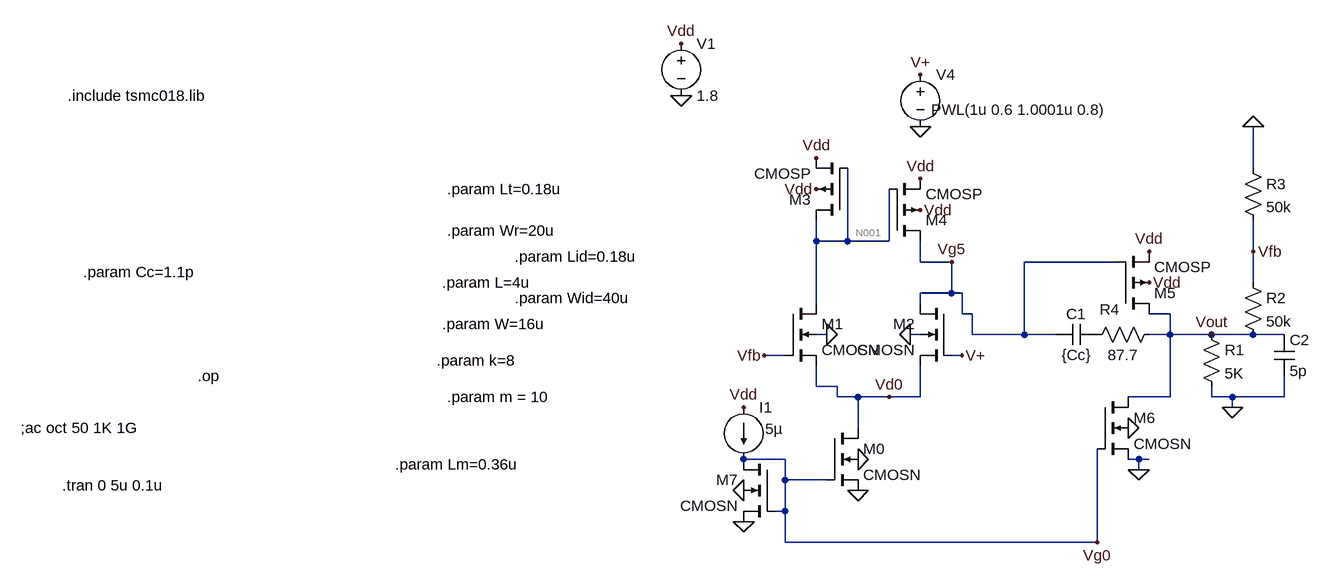
[diagram p0: schematic ProjectLambda.asc]
ProjectLambda.asc, the LTspice schematic file:
Version 4
SHEET 1 2780 868
WIRE 1680 0 1680 -64
WIRE 1008 112 1008 80
WIRE 1056 112 1056 0
WIRE 1056 112 1008 112
WIRE 1120 112 1120 32
WIRE 1120 112 1056 112
WIRE 1680 128 1680 80
WIRE 1168 144 1168 112
WIRE 1216 144 1168 144
WIRE 1472 144 1328 144
WIRE 1680 176 1680 128
WIRE 1216 192 1216 144
WIRE 1216 192 1168 192
WIRE 1232 192 1216 192
WIRE 1008 208 1008 112
WIRE 1168 208 1168 192
WIRE 1232 224 1232 192
WIRE 1248 224 1232 224
WIRE 1552 224 1520 224
WIRE 1024 256 1008 256
WIRE 1168 256 1152 256
WIRE 1248 256 1248 224
WIRE 1328 256 1328 144
WIRE 1328 256 1248 256
WIRE 1376 256 1328 256
WIRE 1552 256 1552 224
WIRE 1552 256 1520 256
WIRE 1616 256 1552 256
WIRE 1680 256 1616 256
WIRE 1728 256 1680 256
WIRE 960 288 928 288
WIRE 1232 288 1216 288
WIRE 1008 336 1008 304
WIRE 1040 336 1008 336
WIRE 1040 352 1040 336
WIRE 1072 352 1040 352
WIRE 1120 352 1072 352
WIRE 1168 352 1168 304
WIRE 1168 352 1120 352
WIRE 1552 352 1552 256
WIRE 1552 352 1488 352
WIRE 1616 352 1616 336
WIRE 1648 352 1616 352
WIRE 1728 352 1728 320
WIRE 1728 352 1648 352
WIRE 1648 368 1648 352
WIRE 1072 400 1072 352
WIRE 960 448 896 448
WIRE 1504 448 1488 448
WIRE 1520 448 1504 448
WIRE 1504 464 1504 448
WIRE 960 480 960 448
WIRE 1024 480 960 480
WIRE 960 528 960 480
WIRE 960 528 944 528
WIRE 960 576 960 528
WIRE 1440 576 1440 432
WIRE 1440 576 960 576
FLAG 800 -112 0
FLAG 896 544 0
FLAG 1072 496 0
FLAG 1504 464 0
FLAG 800 -192 Vdd
FLAG 1008 -16 Vdd
FLAG 1168 16 Vdd
FLAG 1520 128 Vdd
FLAG 1648 368 0
FLAG 1232 288 V+
FLAG 1168 -144 V+
FLAG 1168 -64 0
FLAG 1680 -64 0
FLAG 1680 128 Vfb
FLAG 1616 256 Vout
FLAG 928 288 Vfb
FLAG 1520 176 Vdd
FLAG 1072 448 0
FLAG 896 496 0
FLAG 1168 64 Vdd
FLAG 1008 32 Vdd
FLAG 1152 256 0
FLAG 1024 256 0
FLAG 1440 576 Vg0
FLAG 1216 144 Vg5
FLAG 1120 352 Vd0
FLAG 896 368 Vdd
FLAG 1488 400 0
DATAFLAG 1552 336 ""
DATAFLAG 1168 352 ""
DATAFLAG 1248 224 ""
DATAFLAG 1200 576 ""
SYMBOL voltage 800 -208 R0
WINDOW 123 0 0 Left 0
WINDOW 39 0 0 Left 0
SYMATTR InstName V1
SYMATTR Value 1.8
SYMBOL cmosn 944 448 M0
SYMATTR InstName M7
SYMATTR Value2 l={L} w={W} ad={W*Lm} as={W*Lm} pd={2*(W+Lm)} ps={2*(W+Lm)}
SYMBOL cmosp 1056 80 R180
SYMATTR InstName M3
SYMATTR Value2 l={Lt} w={Wr} ad={Wr*Lm} as={Wr*Lm} pd={2*(Wr+Lm)} ps={2*(Wr+Lm)}
SYMBOL current 896 368 R0
WINDOW 123 0 0 Left 0
WINDOW 39 0 0 Left 0
WINDOW 3 33 33 Left 2
SYMATTR Value 5µ
SYMATTR InstName I1
SYMBOL cap 1440 240 R90
WINDOW 0 0 32 VBottom 2
WINDOW 3 32 32 VTop 2
SYMATTR InstName C1
SYMATTR Value {Cc}
SYMBOL res 1600 240 R0
SYMATTR InstName R1
SYMATTR Value 5K
SYMBOL cap 1712 256 R0
SYMATTR InstName C2
SYMATTR Value 5p
SYMBOL cmosn 1024 400 R0
SYMATTR InstName M0
SYMATTR Value2 l={L} w={m*W} ad={m*W*Lm} as={m*W*Lm} pd={2*(10*W+Lm)} ps={2*(m*10*W+Lm)}
SYMBOL cmosn 1440 352 R0
SYMATTR InstName M6
SYMATTR Value2 l={L} w={k*m*W} ad={k*m*W*Lm} as={k*m*W*Lm} pd={2*(k*m*W+Lm)} ps={2*(k*m*W+Lm)}
SYMBOL cmosn 960 208 R0
SYMATTR InstName M1
SYMATTR Value2 l={Lid} w={Wid} ad={Wid*Lm} as={Wid*Lm} pd={2*(Wid+Lm)} ps={2*(Wid+Lm)}
SYMBOL cmosp 1120 112 M180
SYMATTR InstName M4
SYMATTR Value2 l={Lt} w={Wr} ad={Wr*Lm} as={Wr*Lm} pd={2*(Wr+Lm)} ps={2*(Wr+Lm)}
SYMBOL cmosp 1472 224 M180
SYMATTR InstName M5
SYMATTR Value2 l={Lt} w={2*k*Wr} ad={2*k*Wr*Lm} as={2*k*Wr*Lm} pd={2*(2*k*Wr+Lm)} ps={2*(2*k*Wr+Lm)}
SYMBOL res 1664 160 R0
SYMATTR InstName R2
SYMATTR Value 50k
SYMBOL voltage 1168 -160 R0
WINDOW 123 0 0 Left 0
WINDOW 39 0 0 Left 0
WINDOW 3 17 70 Left 2
SYMATTR Value PWL(1u 0.6 1.0001u 0.8)
SYMATTR InstName V4
SYMBOL cmosn 1216 208 M0
SYMATTR InstName M2
SYMATTR Value2 l={Lid} w={Wid} ad={Wid*Lm} as={Wid*Lm} pd={2*(Wid+Lm)} ps={2*(Wid+Lm)}
SYMBOL res 1664 -16 R0
SYMATTR InstName R3
SYMATTR Value 50k
SYMBOL res 1536 240 R90
WINDOW 0 -7 77 VBottom 2
WINDOW 3 32 56 VTop 2
SYMATTR InstName R4
SYMATTR Value 87.7
TEXT -144 -112 Left 2 !.include tsmc018.lib
TEXT 432 176 Left 2 !.param L=4u
TEXT 432 240 Left 2 !.param W=16u
TEXT -216 400 Left 2 !;ac oct 50 1K 1G
TEXT 424 296 Left 2 !.param k=8
TEXT -152 488 Left 2 !.tran 0 5u 0.1u
TEXT 440 352 Left 2 !.param m = 10
TEXT 360 456 Left 2 !.param Lm=0.36u
TEXT 440 96 Left 2 !.param Wr=20u
TEXT -120 160 Left 2 !.param Cc=1.1p
TEXT 544 136 Left 2 !.param Lid=0.18u
TEXT 544 200 Left 2 !.param Wid=40u
TEXT 440 32 Left 2 !.param Lt=0.18u
TEXT 56 320 Left 2 !.op

The netlist it stands for:
* ProjectLambda.asc
V1 Vdd 0 1.8
M7 Vg0 Vg0 0 0 CMOSN l={L} w={W} ad={W*Lm} as={W*Lm} pd={2*(W+Lm)} ps={2*(W+Lm)}
M3 N001 N001 Vdd Vdd CMOSP l={Lt} w={Wr} ad={Wr*Lm} as={Wr*Lm} pd={2*(Wr+Lm)} ps={2*(Wr+Lm)}
I1 Vdd Vg0 5µ
C1 P001 Vg5 {Cc}
R1 Vout 0 5K
C2 Vout 0 5p
M0 Vd0 Vg0 0 0 CMOSN l={L} w={m*W} ad={m*W*Lm} as={m*W*Lm} pd={2*(10*W+Lm)} ps={2*(m*10*W+Lm)}
M6 Vout Vg0 0 0 CMOSN l={L} w={k*m*W} ad={k*m*W*Lm} as={k*m*W*Lm} pd={2*(k*m*W+Lm)} ps={2*(k*m*W+Lm)}
M1 N001 Vfb Vd0 0 CMOSN l={Lid} w={Wid} ad={Wid*Lm} as={Wid*Lm} pd={2*(Wid+Lm)} ps={2*(Wid+Lm)}
M4 Vg5 N001 Vdd Vdd CMOSP l={Lt} w={Wr} ad={Wr*Lm} as={Wr*Lm} pd={2*(Wr+Lm)} ps={2*(Wr+Lm)}
M5 Vout Vg5 Vdd Vdd CMOSP l={Lt} w={2*k*Wr} ad={2*k*Wr*Lm} as={2*k*Wr*Lm} pd={2*(2*k*Wr+Lm)} ps={2*(2*k*Wr+Lm)}
R2 Vfb Vout 50k
V4 V+ 0 PWL(1u 0.6 1.0001u 0.8)
M2 Vg5 V+ Vd0 0 CMOSN l={Lid} w={Wid} ad={Wid*Lm} as={Wid*Lm} pd={2*(Wid+Lm)} ps={2*(Wid+Lm)}
R3 0 Vfb 50k
R4 Vout P001 87.7
.model NMOS NMOS
.model PMOS PMOS
.lib standard.mos
.include tsmc018.lib
.param L=4u
.param W=16u
;ac oct 50 1K 1G
.param k=8
.tran 0 5u 0.1u
.param m = 10
.param Lm=0.36u
.param Wr=20u
.param Cc=1.1p
.param Lid=0.18u
.param Wid=40u
.param Lt=0.18u
.op
.backanno
.end

* Results of the author's LTspice run, read from the files saved beside the schematic
* Operating Point, zero values left out:
*   V(vdd) = 1.8 V
*   V(vg0) = 480.2 mV
*   V(n001) = 1.254 V
*   V(p001) = 1.198 V
*   V(vg5) = 1.224 V
*   V(vout) = 1.198 V
*   V(vd0) = 132.7 mV
*   V(vfb) = 598.9 mV
*   V(v+) = 600 mV
*   Id(M5) = -664.6 µA
*   Is(M5) = 664.6 µA
*   Id(M4) = -24.09 µA
*   Is(M4) = 24.09 µA
*   Id(M3) = -23.9 µA
*   Is(M3) = 23.9 µA
*   Id(M2) = 24.09 µA
*   Ib(M2) = -1.359 pA
*   Is(M2) = -24.09 µA
*   Id(M1) = 23.9 µA
*   Ib(M1) = -1.39 pA
*   Is(M1) = -23.9 µA
*   Id(M6) = 413 µA
*   Ib(M6) = -1.244 pA
*   Is(M6) = -413 µA
*   Id(M0) = 47.98 µA
*   Is(M0) = -47.98 µA
*   Id(M7) = 5 µA
*   Is(M7) = -5 µA
*   I(I1) = 5 µA
*   I(R3) = -11.98 µA
*   I(R2) = -11.98 µA
*   I(R1) = 239.6 µA
*   I(V1) = -717.6 µA
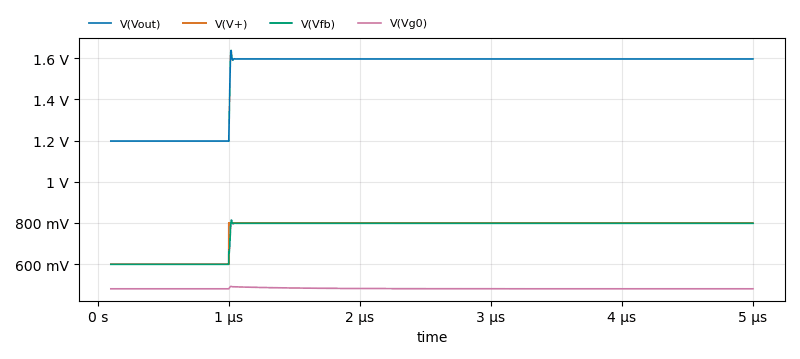
[diagram p1: Transient Analysis of ProjectLambda.asc, plotted from the saved traces]
* Transient Analysis, 1 run:
*   V(Vout): min 1.198 V, max 1.639 V, average 1.523 V, rms 1.531 V, last 1.597 V
*   V(V+): min 600 mV, max 800 mV, average 763.3 mV, rms 767.2 mV, last 800 mV
*   V(Vfb): min 598.9 mV, max 814.5 mV, average 761.5 mV, rms 765.4 mV, last 798.4 mV
*   V(Vg0): min 480.2 mV, max 491.6 mV, average 481.3 mV, rms 481.3 mV, last 480.2 mV